# Altium schematic sheet Top Level.SchDoc
size A4
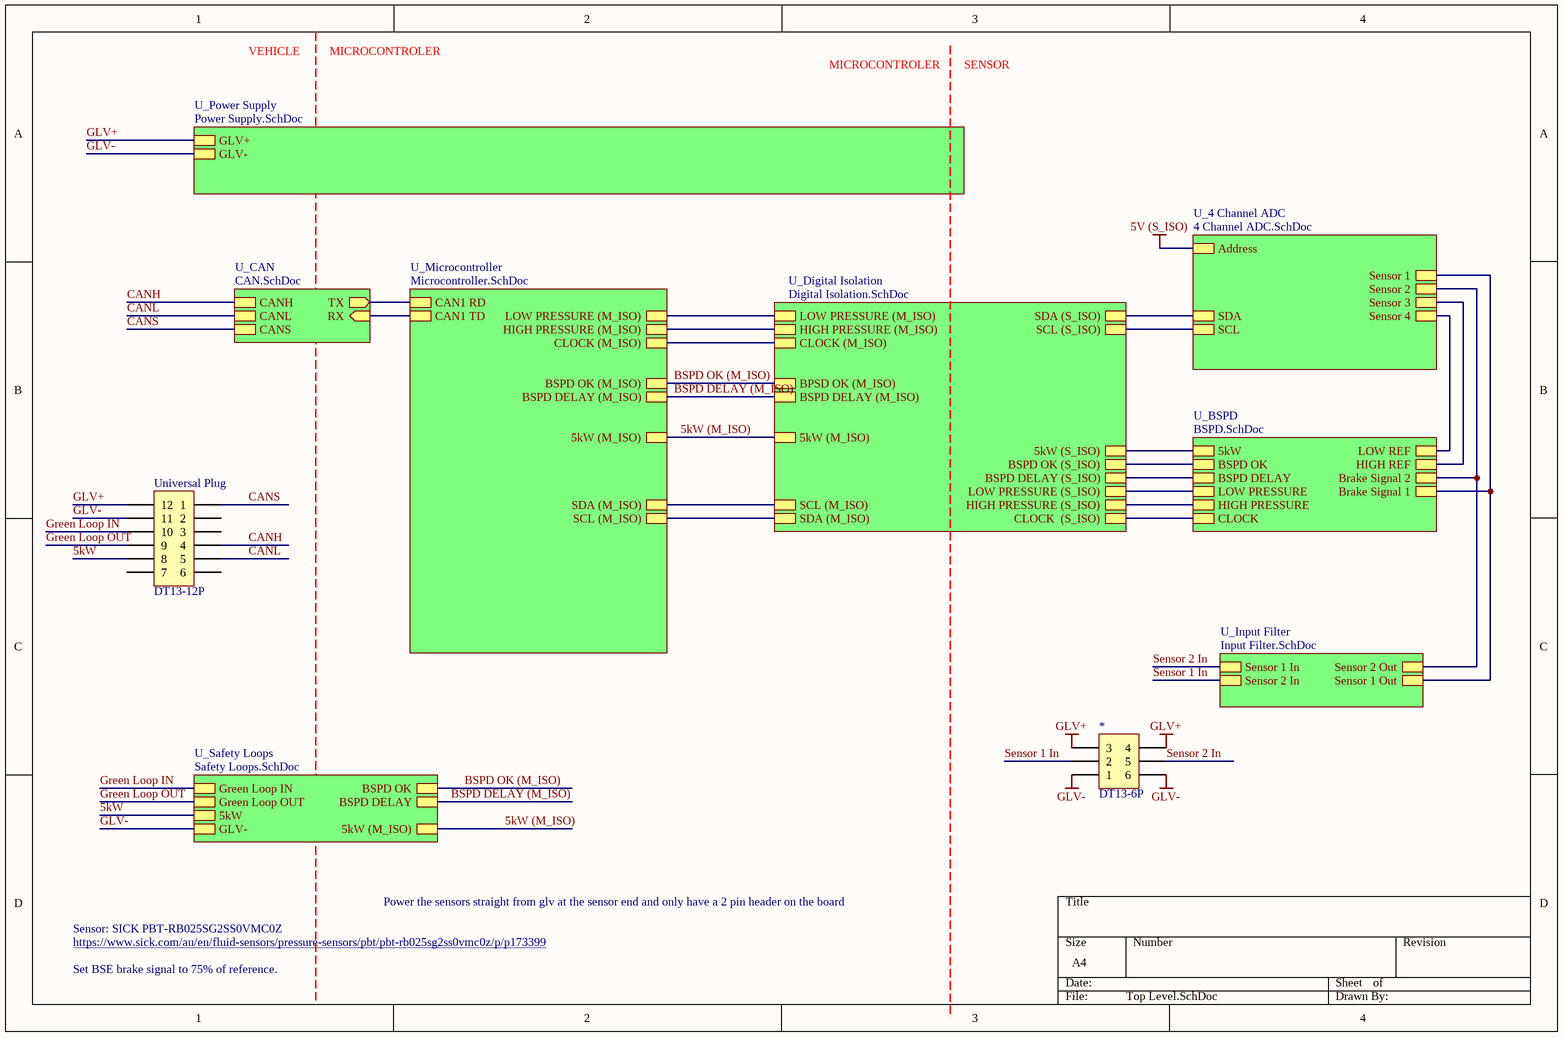
[diagram p0: Top Level.SchDoc]

## Parts
*  DT13-6P  [DT13-6P]
Universal_Plug  DT13-12P  [DT13-12P]

## Sub-sheets
U_4 Channel ADC = 4 Channel ADC.SchDoc: Address, SCL, SDA, Sensor 1, Sensor 2, Sensor 3, Sensor 4
U_BSPD = BSPD.SchDoc: BSPD OK, HIGH PRESSURE, LOW PRESSURE, CLOCK, HIGH REF, LOW REF, 5kW, Brake Signal 1, Brake Signal 2, BSPD DELAY
U_CAN = CAN.SchDoc: CANS, RX (in), CANL, CANH, TX (out)
U_Digital Isolation = Digital Isolation.SchDoc: SDA (M_ISO), SCL (M_ISO), SDA (S_ISO), SCL (S_ISO), CLOCK (M_ISO), HIGH PRESSURE (M_ISO), LOW PRESSURE (M_ISO), BPSD OK (M_ISO), 5kW (S_ISO), 5kW (M_ISO), BSPD OK (S_ISO), HIGH PRESSURE (S_ISO), LOW PRESSURE (S_ISO), CLOCK  (S_ISO), BSPD DELAY (S_ISO), BSPD DELAY (M_ISO)
U_Input Filter = Input Filter.SchDoc: Sensor 1 In, Sensor 1 Out, Sensor 2 In, Sensor 2 Out
U_Microcontroller = Microcontroller.SchDoc: BSPD OK (M_ISO), 5kW (M_ISO), CLOCK (M_ISO), HIGH PRESSURE (M_ISO), LOW PRESSURE (M_ISO), SDA (M_ISO), SCL (M_ISO), CAN1 RD, CAN1 TD, BSPD DELAY (M_ISO)
U_Power Supply = Power Supply.SchDoc: GLV+, GLV-
U_Safety Loops = Safety Loops.SchDoc: Green Loop OUT, Green Loop IN, BSPD OK, BSPD DELAY, 5kW, 5kW (M_ISO), GLV-

## Nets
5V (S_ISO): sheet U_4 Channel ADC/Address
GLV+: *.3 *.4 Universal_Plug.12 ; sheet U_Power Supply/GLV+
GLV-: *.1 *.6 Universal_Plug.11 ; sheet U_Safety Loops/GLV-, sheet U_Power Supply/GLV-
5kW: Universal_Plug.8 ; sheet U_Safety Loops/5kW
5kW (M_ISO): sheet U_Digital Isolation/5kW (M_ISO), sheet U_Microcontroller/5kW (M_ISO), sheet U_Safety Loops/5kW (M_ISO)
BSPD DELAY (M_ISO): sheet U_Digital Isolation/BSPD DELAY (M_ISO), sheet U_Microcontroller/BSPD DELAY (M_ISO), sheet U_Safety Loops/BSPD DELAY
BSPD OK (M_ISO): sheet U_Digital Isolation/BPSD OK (M_ISO), sheet U_Microcontroller/BSPD OK (M_ISO), sheet U_Safety Loops/BSPD OK
CANH: Universal_Plug.4 ; sheet U_CAN/CANH
CANL: Universal_Plug.5 ; sheet U_CAN/CANL
CANS: Universal_Plug.1 ; sheet U_CAN/CANS
Green Loop IN: Universal_Plug.10 ; sheet U_Safety Loops/Green Loop IN
Green Loop OUT: Universal_Plug.9 ; sheet U_Safety Loops/Green Loop OUT
Sensor 1 In: *.2 ; sheet U_Input Filter/Sensor 2 In
Sensor 2 In: *.5 ; sheet U_Input Filter/Sensor 1 In
(unnamed): sheet U_BSPD/BSPD OK, sheet U_Digital Isolation/BSPD OK (S_ISO)
(unnamed): sheet U_BSPD/HIGH PRESSURE, sheet U_Digital Isolation/HIGH PRESSURE (S_ISO)
(unnamed): sheet U_BSPD/LOW PRESSURE, sheet U_Digital Isolation/LOW PRESSURE (S_ISO)
(unnamed): sheet U_BSPD/CLOCK, sheet U_Digital Isolation/CLOCK  (S_ISO)
(unnamed): sheet U_BSPD/HIGH REF, sheet U_4 Channel ADC/Sensor 3
(unnamed): sheet U_BSPD/LOW REF, sheet U_4 Channel ADC/Sensor 4
(unnamed): sheet U_BSPD/5kW, sheet U_Digital Isolation/5kW (S_ISO)
(unnamed): sheet U_BSPD/Brake Signal 1, sheet U_4 Channel ADC/Sensor 1, sheet U_Input Filter/Sensor 1 Out
(unnamed): sheet U_BSPD/Brake Signal 2, sheet U_4 Channel ADC/Sensor 2, sheet U_Input Filter/Sensor 2 Out
(unnamed): sheet U_BSPD/BSPD DELAY, sheet U_Digital Isolation/BSPD DELAY (S_ISO)
(unnamed): sheet U_4 Channel ADC/SCL, sheet U_Digital Isolation/SCL (S_ISO)
(unnamed): sheet U_4 Channel ADC/SDA, sheet U_Digital Isolation/SDA (S_ISO)
(unnamed): sheet U_Digital Isolation/SDA (M_ISO), sheet U_Microcontroller/SCL (M_ISO)
(unnamed): sheet U_Digital Isolation/SCL (M_ISO), sheet U_Microcontroller/SDA (M_ISO)
(unnamed): sheet U_Digital Isolation/CLOCK (M_ISO), sheet U_Microcontroller/CLOCK (M_ISO)
(unnamed): sheet U_Digital Isolation/HIGH PRESSURE (M_ISO), sheet U_Microcontroller/HIGH PRESSURE (M_ISO)
(unnamed): sheet U_Digital Isolation/LOW PRESSURE (M_ISO), sheet U_Microcontroller/LOW PRESSURE (M_ISO)
(unnamed): sheet U_Microcontroller/CAN1 RD, sheet U_CAN/TX
(unnamed): sheet U_Microcontroller/CAN1 TD, sheet U_CAN/RX

Not connected (* = marked no-connect by the designer): Universal_Plug 2 3 6 7

## Notes on the sheet
- VEHICLE
- MICROCONTROLER
- SENSOR
- Power the sensors straight from glv at the sensor end and only have a 2 pin header on the board
- Sensor: SICK PBT-RB025SG2SS0VMC0Z
- https://www.sick.com/au/en/fluid-sensors/pressure-sensors/pbt/pbt-rb025sg2ss0vmc0z/p/p173399
- Set BSE brake signal to 75% of reference.

## Library data of the parts
* = DT13-6P[[/\]]DT13-6P: Positions: 6; Pitch: 4.44mm; Row Spacing: 6.35mm; Angle: 90; Flange: Yes; Contact: Copper Alloy; Part Number: DT13-6P; Digikey Part Number: 1734-1025-ND; Digikey Link: https://www.digikey.com/product-detail/en/te-connectivity-deutsch-connectors/DT13-6P/1734-1025-ND/6566589
Universal_Plug = DT13-12P[[/\]]DT13-12P: Positions: 12; Pitch: 4.44mm; Row Spacing: 6.35mm; Angle: 90; Flange: Yes; Contact: Nickel; Part Number: DT13-12P; Digikey Part Number: 1734-1451-ND; Digikey Link: https://www.digikey.com.au/product-detail/en/te-connectivity-deutsch-connectors/DT13-12PA/1734-1451-ND/7220123